# Altium schematic sheet Motor_Driver.SchDoc
size 420 x 297 mm; SheetNumber: 5; SheetTotal: 6; Разработчик: Волков; Проверяющий: Андрейчук; Технический_контроль: Ашуркевич; Нормативный_контроль: Василевская; Утвердил: Чвала; Номер_листа: 1; Количество_листов: 4; Организация: МРК; Номер_документа: ТЗСЦ.421457.001Э3; Название_документа: Устройство управления сервоприводами на основе микроконтроллера STM32
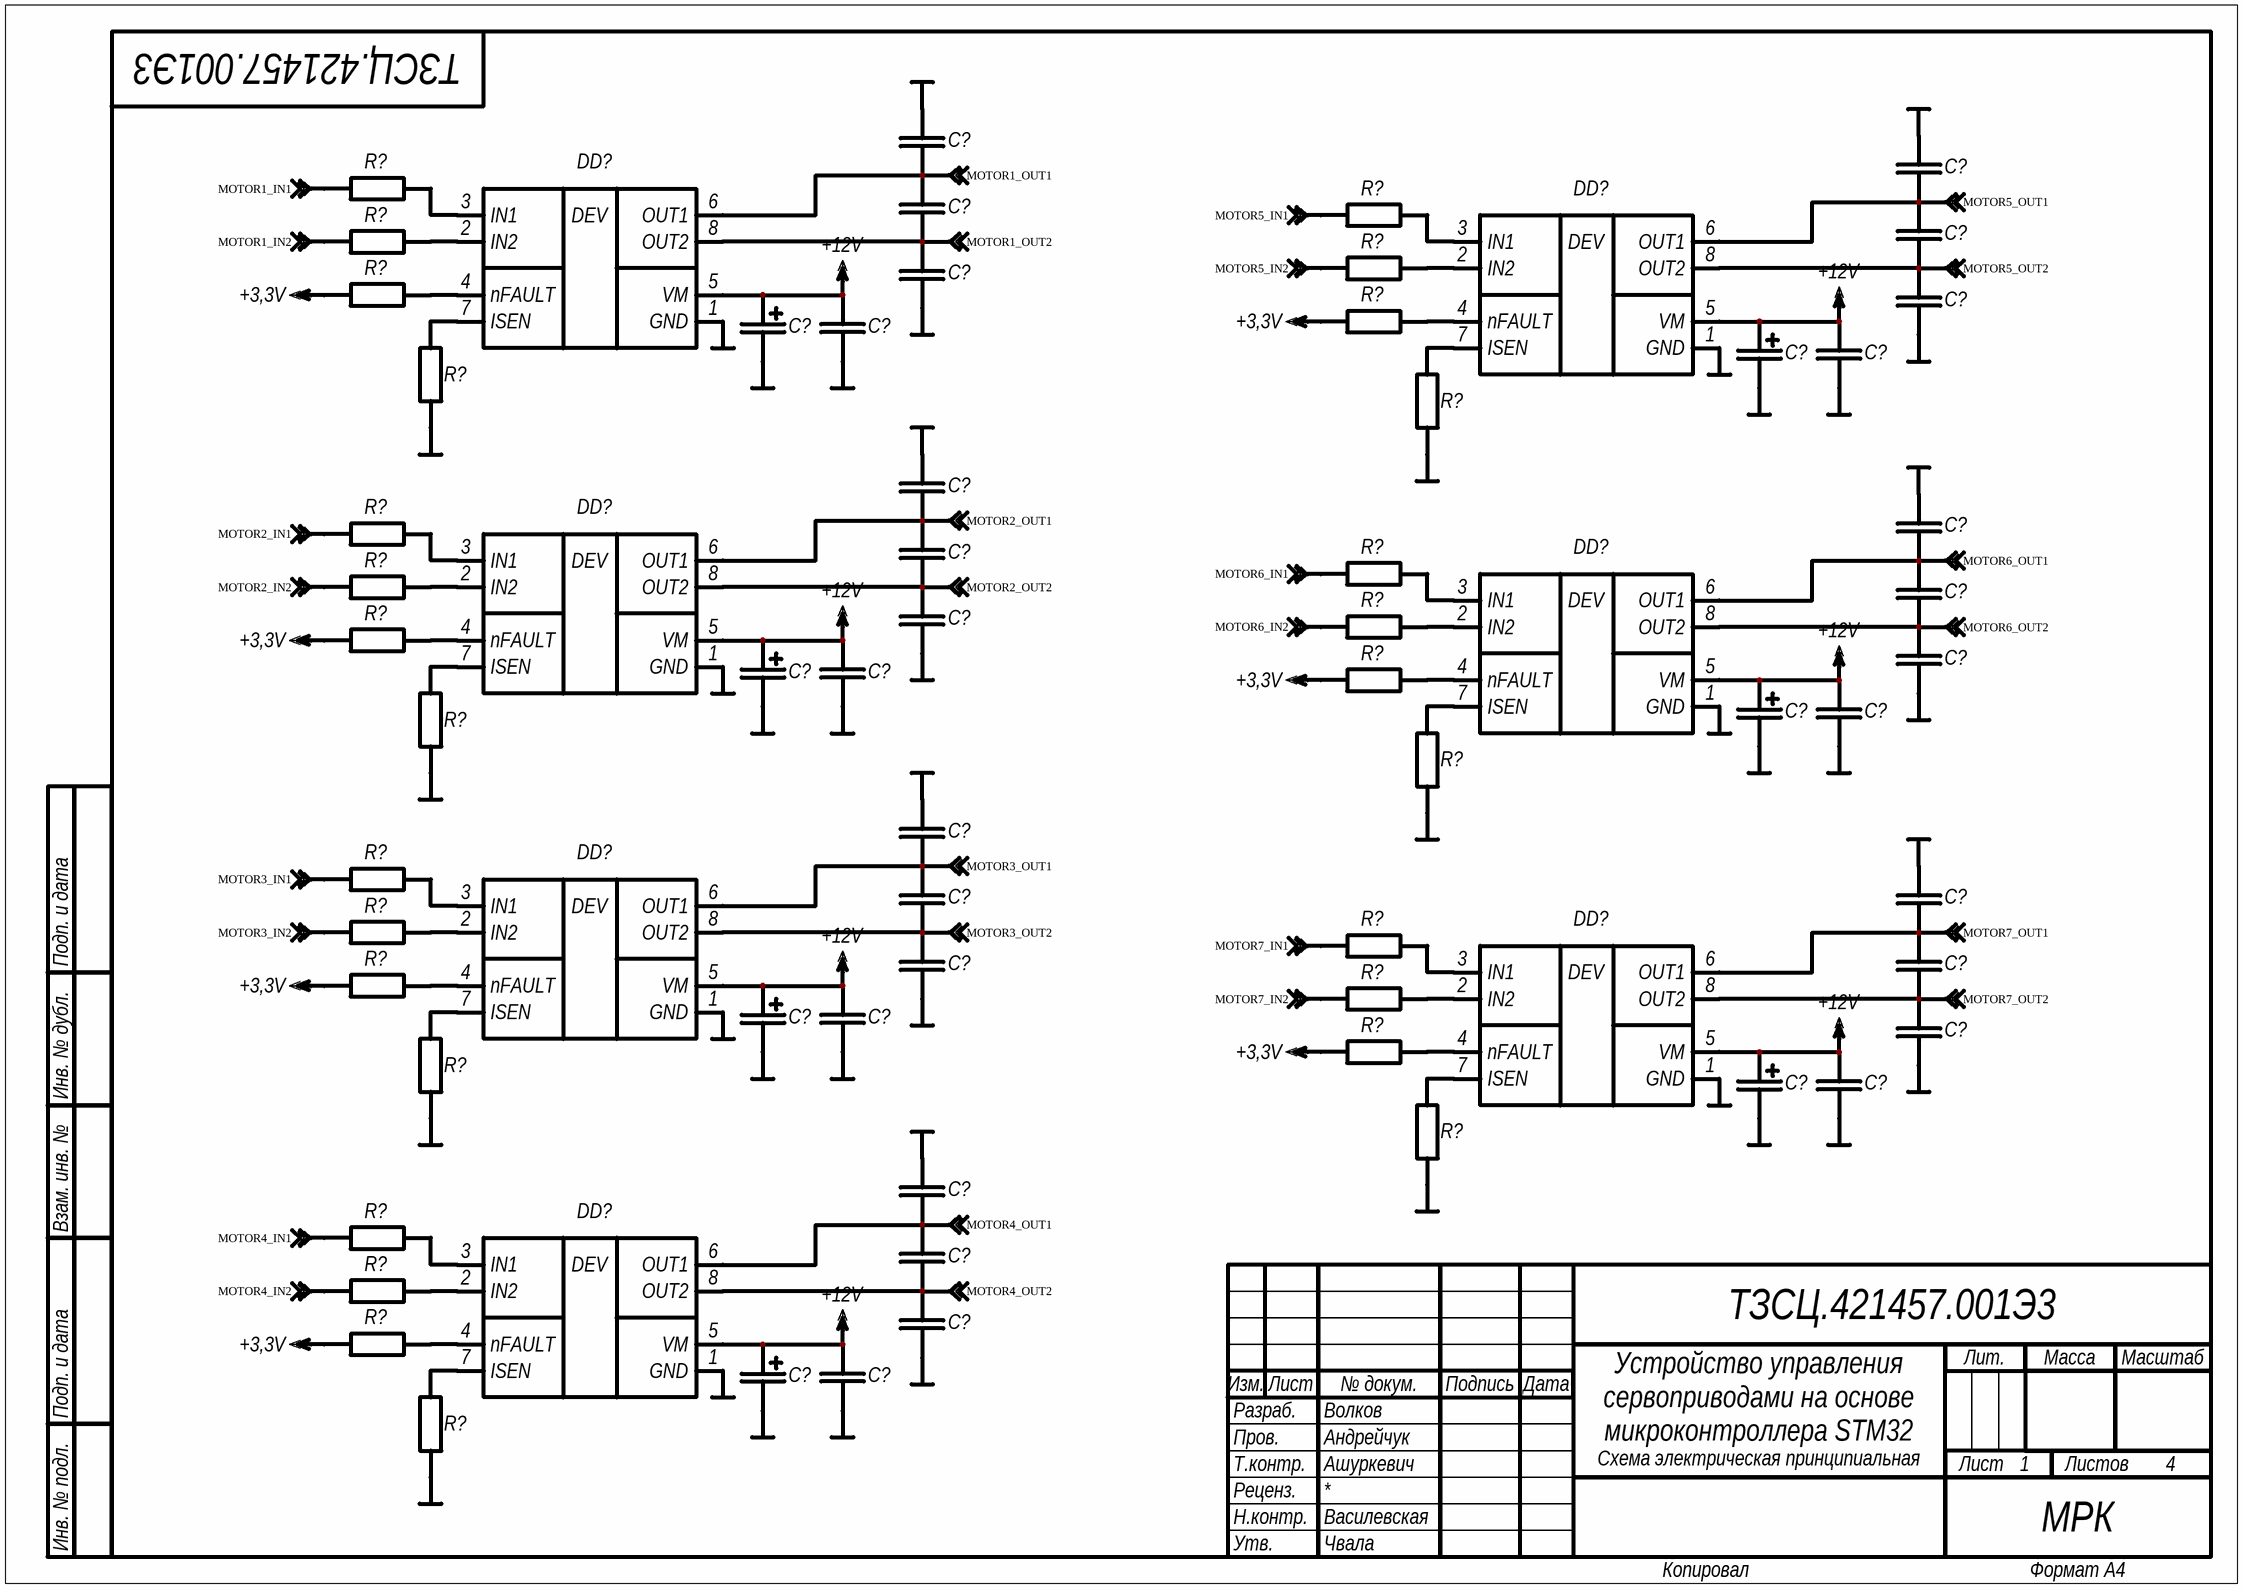
[diagram p0: Motor_Driver.SchDoc]

## Parts
(Parts that share a designator on the sheet are numbered #1, #2 ... from top to bottom, then left to right.)
C?#1  Capacitor_Fixed  (value not drawn)
C?#2  Capacitor_Fixed  (value not drawn)
C?#3  Capacitor_Fixed  (value not drawn)
C?#4  Capacitor_Fixed  (value not drawn)
C?#5  Capacitor_Polarized  (value not drawn)
C?#6  Capacitor_Fixed  (value not drawn)
C?#7  Capacitor_Polarized  (value not drawn)
C?#8  Capacitor_Fixed  (value not drawn)
C?#9  Capacitor_Fixed  (value not drawn)
C?#10  Capacitor_Fixed  (value not drawn)
C?#11  Capacitor_Fixed  (value not drawn)
C?#12  Capacitor_Fixed  (value not drawn)
C?#13  Capacitor_Fixed  (value not drawn)
C?#14  Capacitor_Fixed  (value not drawn)
C?#15  Capacitor_Polarized  (value not drawn)
C?#16  Capacitor_Fixed  (value not drawn)
C?#17  Capacitor_Polarized  (value not drawn)
C?#18  Capacitor_Fixed  (value not drawn)
C?#19  Capacitor_Fixed  (value not drawn)
C?#20  Capacitor_Fixed  (value not drawn)
C?#21  Capacitor_Fixed  (value not drawn)
C?#22  Capacitor_Fixed  (value not drawn)
C?#23  Capacitor_Fixed  (value not drawn)
C?#24  Capacitor_Polarized  (value not drawn)
C?#25  Capacitor_Fixed  (value not drawn)
C?#26  Capacitor_Fixed  (value not drawn)
C?#27  Capacitor_Fixed  (value not drawn)
C?#28  Capacitor_Polarized  (value not drawn)
C?#29  Capacitor_Fixed  (value not drawn)
C?#30  Capacitor_Fixed  (value not drawn)
C?#31  Capacitor_Fixed  (value not drawn)
C?#32  Capacitor_Fixed  (value not drawn)
C?#33  Capacitor_Polarized  (value not drawn)
C?#34  Capacitor_Fixed  (value not drawn)
C?#35  Capacitor_Fixed  (value not drawn)
DD?#1  AT8236  (value not drawn)
DD?#2  AT8236  (value not drawn)
DD?#3  AT8236  (value not drawn)
DD?#4  AT8236  (value not drawn)
DD?#5  AT8236  (value not drawn)
DD?#6  AT8236  (value not drawn)
DD?#7  AT8236  (value not drawn)
R?#1  Resistor_Fixed  (value not drawn)
R?#2  Resistor_Fixed  (value not drawn)
R?#3  Resistor_Fixed  (value not drawn)
R?#4  Resistor_Fixed  (value not drawn)
R?#5  Resistor_Fixed  (value not drawn)
R?#6  Resistor_Fixed  (value not drawn)
R?#7  Resistor_Fixed  (value not drawn)
R?#8  Resistor_Fixed  (value not drawn)
R?#9  Resistor_Fixed  (value not drawn)
R?#10  Resistor_Fixed  (value not drawn)
R?#11  Resistor_Fixed  (value not drawn)
R?#12  Resistor_Fixed  (value not drawn)
R?#13  Resistor_Fixed  (value not drawn)
R?#14  Resistor_Fixed  (value not drawn)
R?#15  Resistor_Fixed  (value not drawn)
R?#16  Resistor_Fixed  (value not drawn)
R?#17  Resistor_Fixed  (value not drawn)
R?#18  Resistor_Fixed  (value not drawn)
R?#19  Resistor_Fixed  (value not drawn)
R?#20  Resistor_Fixed  (value not drawn)
R?#21  Resistor_Fixed  (value not drawn)
R?#22  Resistor_Fixed  (value not drawn)
R?#23  Resistor_Fixed  (value not drawn)
R?#24  Resistor_Fixed  (value not drawn)
R?#25  Resistor_Fixed  (value not drawn)
R?#26  Resistor_Fixed  (value not drawn)
R?#27  Resistor_Fixed  (value not drawn)
R?#28  Resistor_Fixed  (value not drawn)

## Nets
+3,3V: R?#5.1 R?#6.1 R?#13.1 R?#14.1 R?#20.1 R?#22.1 R?#27.1
+12V: C?#5.1(Anode) C?#7.1(Anode) C?#9.2 C?#10.2 C?#15.1(Anode) C?#17.1(Anode) C?#19.2 C?#20.2 C?#24.1(Anode) C?#27.2 C?#28.1(Anode) C?#30.2 C?#33.1(Anode) C?#35.2 DD?#1.5(VM) DD?#2.5(VM) DD?#3.5(VM) DD?#4.5(VM) DD?#5.5(VM) DD?#6.5(VM) DD?#7.5(VM)
GND: C?#1.2 C?#2.2 C?#5.2(Cathode) C?#6.1 C?#7.2(Cathode) C?#8.1 C?#9.1 C?#10.1 C?#11.2 C?#12.2 C?#15.2(Cathode) C?#16.1 C?#17.2(Cathode) C?#18.1 C?#19.1 C?#20.1 C?#21.2 C?#23.2 C?#24.2(Cathode) C?#25.1 C?#27.1 C?#28.2(Cathode) C?#29.1 C?#30.1 C?#31.2 C?#33.2(Cathode) C?#34.1 C?#35.1 DD?#1.1(GND) DD?#2.1(GND) DD?#3.1(GND) DD?#4.1(GND) DD?#5.1(GND) DD?#6.1(GND) DD?#7.1(GND) R?#7.1 R?#8.1 R?#15.1 R?#16.1 R?#23.1 R?#24.1 R?#28.1
MOTOR1_IN1: R?#1.1 ; off-sheet MOTOR1_IN1
MOTOR1_IN2: R?#3.1 ; off-sheet MOTOR1_IN2
MOTOR1_OUT1: C?#1.1 C?#3.2 DD?#1.6(OUT1) ; off-sheet MOTOR1_OUT1
MOTOR1_OUT2: C?#3.1 C?#6.2 DD?#1.8(OUT2) ; off-sheet MOTOR1_OUT2
MOTOR2_IN1: R?#9.1 ; off-sheet MOTOR2_IN1
MOTOR2_IN2: R?#11.1 ; off-sheet MOTOR2_IN2
MOTOR2_OUT1: C?#11.1 C?#13.2 DD?#3.6(OUT1) ; off-sheet MOTOR2_OUT1
MOTOR2_OUT2: C?#13.1 C?#16.2 DD?#3.8(OUT2) ; off-sheet MOTOR2_OUT2
MOTOR3_IN1: R?#17.1 ; off-sheet MOTOR3_IN1
MOTOR3_IN2: R?#18.1 ; off-sheet MOTOR3_IN2
MOTOR3_OUT1: C?#21.1 C?#22.2 DD?#5.6(OUT1) ; off-sheet MOTOR3_OUT1
MOTOR3_OUT2: C?#22.1 C?#25.2 DD?#5.8(OUT2) ; off-sheet MOTOR3_OUT2
MOTOR4_IN1: R?#25.1 ; off-sheet MOTOR4_IN1
MOTOR4_IN2: R?#26.1 ; off-sheet MOTOR4_IN2
MOTOR4_OUT1: C?#31.1 C?#32.2 DD?#7.6(OUT1) ; off-sheet MOTOR4_OUT1
MOTOR4_OUT2: C?#32.1 C?#34.2 DD?#7.8(OUT2) ; off-sheet MOTOR4_OUT2
MOTOR5_IN1: R?#2.1 ; off-sheet MOTOR5_IN1
MOTOR5_IN2: R?#4.1 ; off-sheet MOTOR5_IN2
MOTOR5_OUT1: C?#2.1 C?#4.2 DD?#2.6(OUT1) ; off-sheet MOTOR5_OUT1
MOTOR5_OUT2: C?#4.1 C?#8.2 DD?#2.8(OUT2) ; off-sheet MOTOR5_OUT2
MOTOR6_IN1: R?#10.1 ; off-sheet MOTOR6_IN1
MOTOR6_IN2: R?#12.1 ; off-sheet MOTOR6_IN2
MOTOR6_OUT1: C?#12.1 C?#14.2 DD?#4.6(OUT1) ; off-sheet MOTOR6_OUT1
MOTOR6_OUT2: C?#14.1 C?#18.2 DD?#4.8(OUT2) ; off-sheet MOTOR6_OUT2
MOTOR7_IN1: R?#19.1 ; off-sheet MOTOR7_IN1
MOTOR7_IN2: R?#21.1 ; off-sheet MOTOR7_IN2
MOTOR7_OUT1: C?#23.1 C?#26.2 DD?#6.6(OUT1) ; off-sheet MOTOR7_OUT1
MOTOR7_OUT2: C?#26.1 C?#29.2 DD?#6.8(OUT2) ; off-sheet MOTOR7_OUT2
NetDD?#1_2: DD?#1.2(IN2) R?#3.2
NetDD?#1_3: DD?#1.3(IN1) R?#1.2
NetDD?#1_4: DD?#1.4(nFAULT) R?#5.2
NetDD?#1_7: DD?#1.7(ISEN) R?#7.2
NetDD?#2_2: DD?#2.2(IN2) R?#4.2
NetDD?#2_3: DD?#2.3(IN1) R?#2.2
NetDD?#2_4: DD?#2.4(nFAULT) R?#6.2
NetDD?#2_7: DD?#2.7(ISEN) R?#8.2
NetDD?#3_2: DD?#3.2(IN2) R?#11.2
NetDD?#3_3: DD?#3.3(IN1) R?#9.2
NetDD?#3_4: DD?#3.4(nFAULT) R?#13.2
NetDD?#3_7: DD?#3.7(ISEN) R?#15.2
NetDD?#4_2: DD?#4.2(IN2) R?#12.2
NetDD?#4_3: DD?#4.3(IN1) R?#10.2
NetDD?#4_4: DD?#4.4(nFAULT) R?#14.2
NetDD?#4_7: DD?#4.7(ISEN) R?#16.2
NetDD?#5_2: DD?#5.2(IN2) R?#18.2
NetDD?#5_3: DD?#5.3(IN1) R?#17.2
NetDD?#5_4: DD?#5.4(nFAULT) R?#20.2
NetDD?#5_7: DD?#5.7(ISEN) R?#23.2
NetDD?#6_2: DD?#6.2(IN2) R?#21.2
NetDD?#6_3: DD?#6.3(IN1) R?#19.2
NetDD?#6_4: DD?#6.4(nFAULT) R?#22.2
NetDD?#6_7: DD?#6.7(ISEN) R?#24.2
NetDD?#7_2: DD?#7.2(IN2) R?#26.2
NetDD?#7_3: DD?#7.3(IN1) R?#25.2
NetDD?#7_4: DD?#7.4(nFAULT) R?#27.2
NetDD?#7_7: DD?#7.7(ISEN) R?#28.2

## Notes on the sheet
- Подп. и дата
- Инв. № дубл.
- Взам. инв. №
- Разраб.
- Изм.
- Лист
- № докум.
- Подпись
- Дата
- Лит.
- Масса
- Масштаб
- Пров.
- Т.контр.
- Схема электрическая принципиальная
- Листов
- Реценз.
- Н.контр.
- Утв.
- Инв. № подл.
- Копировал
- Формат А4
- (in symbol Microcircuit_Digital_Motor_Driver_AT8236) DEV

## Library data of the parts
C?#1-C?#4 C?#6 C?#8-C?#14 C?#16 C?#18-C?#23 C?#25-C?#27 C?#29-C?#32 C?#34 C?#35 = Capacitor_Fixed: 2 pin
C?#5 C?#7 C?#15 C?#17 C?#24 C?#28 C?#33 = Capacitor_Polarized: 2 pin
DD?#1-DD?#7 = Microcircuit_Digital_Motor_Driver_AT8236: 8 pin 12V; ComponentLink1Description: chipdip; ComponentLink1URL: https://www.chipdip.by/product0/8015815062; ComponentLink2Description: datasheet; ComponentLink2URL: https://static.chipdip.ru/lib/795/DOC042795118.pdf
R?#1-R?#28 = Resistor_Fixed: 2 pin